# Altium schematic sheet RS485.SchDoc
size A4
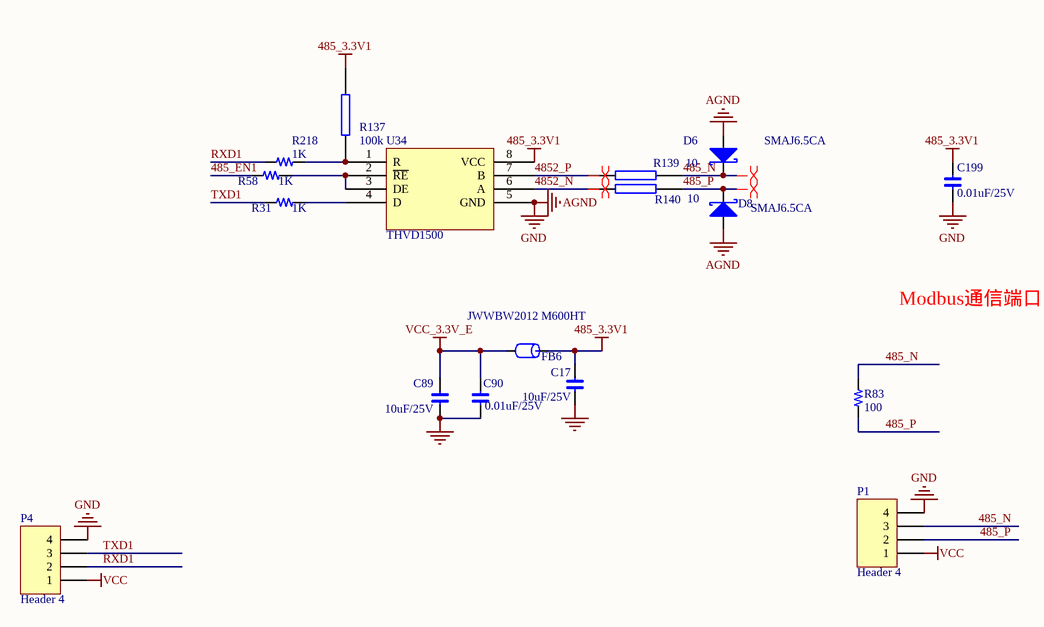
[diagram p0: RS485.SchDoc]

## Parts
C17  10uF/25V  [0603C]
C89  10uF/25V  [0603C]
C90  0.01uF/25V  [0603C]
C199  0.01uF/25V  [0603C]
D6  SMAJ6.5CA  [SMA]
D8  SMAJ6.5CA  [SMA]
FB6  JWWBW2012 M600HT  [0805CZ]
P1  Header 4  [HDR1X4]
P4  Header 4  [HDR1X4]
R31  1K  [0603R]
R58  1K  [0603R]
R83  100  [0603R]
R137  100k  [0603R]
R139  10  [1206R]
R140  10  [1206R]
R218  1K  [0603R]
U34  THVD1500  [so-8]

## Nets
485_3.3V1: C17.2 C199.2 FB6.1 R137.2 U34.8(VCC)
AGND: C17.1 C89.1 C90.1 C199.1 D6.1(A) D8.1(A) P1.4 P4.4 U34.5(GND)  [also labelled GND]
VCC: P1.1 P4.1
VCC_3.3V_E: C89.2 C90.2 FB6.2
485_EN1: R58.2
485_N: D6.2(K) P1.3 R83.2 R139.1
485_P: D8.2(K) P1.2 R83.1 R140.1
4852_N: R140.2 U34.6(A)
4852_P: R139.2 U34.7(B)
RXD1: P4.2 R218.2
TXD1: P4.3 R31.2
NetR31_1: R31.1 U34.4(D)
NetR58_1: R58.1 U34.2(~{RE}) U34.3(DE)
NetR137_1: R137.1 R218.1 U34.1(R)

## Layout directives
differential pair: 485_N, 485_P, 4852_N, 4852_P

## Notes on the sheet
- Modbus通信端口

## Library data of the parts
C17 C89 C90 C199 = C
D6 D8 = DIODE S: Schottky Diode
FB6 = FB: Part Field 1: 磁珠/0603/1K ohm/100MHz; FB: BLM18BD102SN1(muRata); Text Field1: FB
P1 P4 = Header 4: Header, 4-Pin; LatestRevisionDate: 17-Jul-2002; LatestRevisionNote: Re-released for DXP Platform.; Publisher: Altium Limited
R31 R58 R83 R218 = R
R137 R139 R140 = RES2
U34 = SN65HVD06D